# Altium project RyuBoard-Plate.PrjPcb
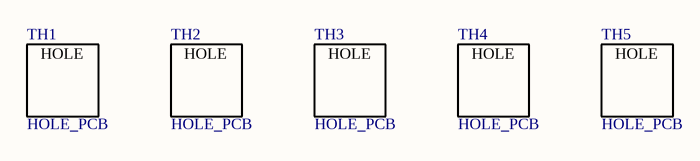
[diagram p0: Ryu-Plate.SchDoc]
1 sheet, 5 parts. Net scope: global (net labels, ports and power ports of the same name join across sheets).
Board file: Ryu-Plate.PcbDoc

## Sheet Ryu-Plate.SchDoc
size A4; SheetNumber: 1; SheetTotal: 1

### Parts
TH1  HOLE_PCB  [M2_PCB_HOLE]
TH2  HOLE_PCB  [M2_PCB_HOLE]
TH3  HOLE_PCB  [M2_PCB_HOLE]
TH4  HOLE_PCB  [M2_PCB_HOLE]
TH5  HOLE_PCB  [M2_PCB_HOLE]

### Notes on the sheet
- (in symbol HOLE_PCB) HOLE